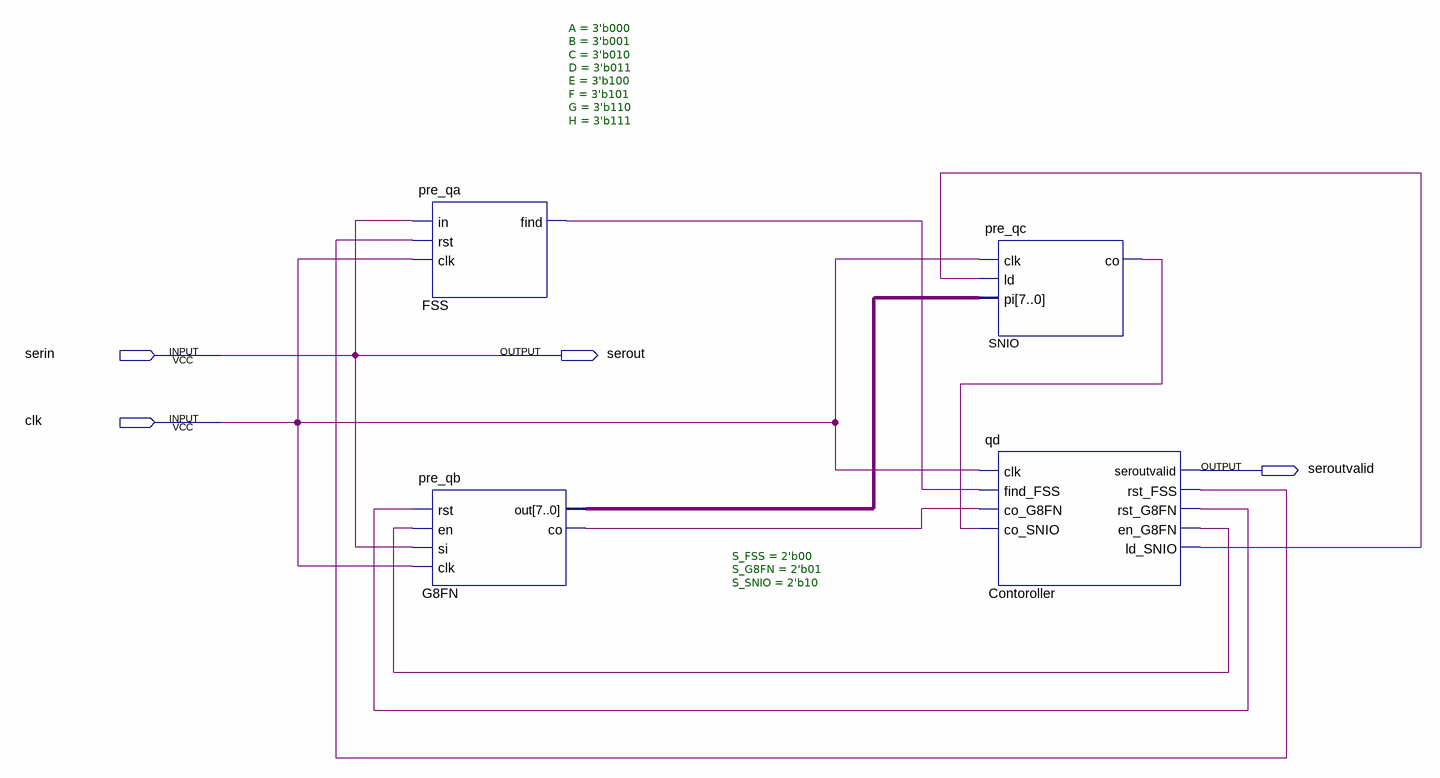
[diagram p0: schematic sheet]
// Quartus schematic ca5_qd.bdf as structural Verilog: 4 symbols, 4 pins
module ca5_qd (
  input  serin,
  input  clk,
  output serout,
  output seroutvalid
);

  wire Contoroller_en_g8fn, Contoroller_ld_snio, Contoroller_rst_fss, Contoroller_rst_g8fn, FSS_find,
       G8FN_co, SNIO_co;
  wire [7:0] G8FN_out;

  pre_qa #(.A(3'b000), .B(3'b001), .C(3'b010), .D(3'b011), .E(3'b100), .F(3'b101), .G(3'b110), .H(3'b111)) FSS (
    .in(serin), .rst(Contoroller_rst_fss), .clk(clk), .find(FSS_find));
  pre_qb G8FN (
    .rst(Contoroller_rst_g8fn), .en(Contoroller_en_g8fn), .si(serin), .clk(clk), .out(G8FN_out), .co(G8FN_co));
  pre_qc SNIO (.clk(clk), .ld(Contoroller_ld_snio), .pi(G8FN_out), .co(SNIO_co));
  qd #(.S_FSS(2'b00), .S_G8FN(2'b01), .S_SNIO(2'b10)) Contoroller (
    .clk(clk), .find_FSS(FSS_find), .co_G8FN(G8FN_co), .co_SNIO(SNIO_co), .seroutvalid(seroutvalid),
    .rst_FSS(Contoroller_rst_fss), .rst_G8FN(Contoroller_rst_g8fn), .en_G8FN(Contoroller_en_g8fn),
    .ld_SNIO(Contoroller_ld_snio));

  assign serout = serin;
endmodule
